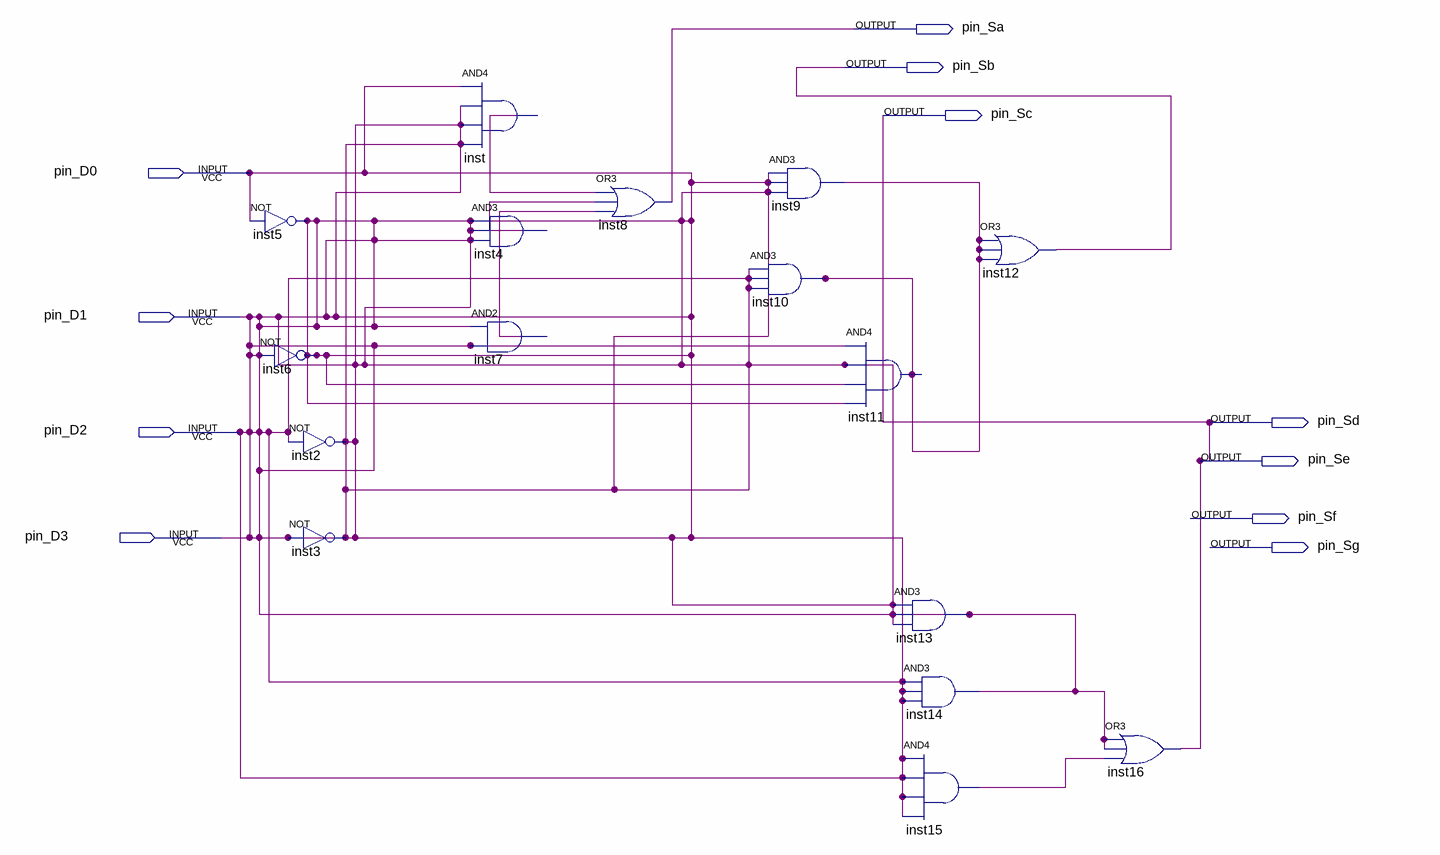
[diagram p0: schematic sheet]
// Quartus schematic Lab3.bdf as structural Verilog: 16 symbols, 11 pins
module Lab3 (
  input  pin_D0,
  input  pin_D1,
  input  pin_D2,
  input  pin_D3,
  output pin_Sa,
  output pin_Sb,
  output pin_Sc,
  output pin_Sd,
  output pin_Se,
  output pin_Sf,
  output pin_Sg
);

  wire inst4_out, inst7_out, inst9_out, inst15_out, inst_out;

  not inst5 (pin_D0, pin_D0);
  not inst6 (pin_D0, pin_D0);
  not inst2 (pin_D0, pin_D0);
  not inst3 (pin_D0, pin_D0);
  and inst (inst_out, pin_D0, pin_D0, pin_D0, pin_D0);
  and inst4 (inst4_out, pin_D0, pin_D0, pin_D0);
  and inst7 (inst7_out, pin_D0, pin_D0);
  or inst8 (pin_Sa, inst_out, inst4_out, inst7_out);
  and inst9 (inst9_out, pin_D0, pin_D0, pin_D0);
  and inst10 (inst9_out, pin_D0, pin_D0, pin_D0);
  and inst11 (inst9_out, pin_D0, pin_D0, pin_D0, pin_D0);
  and inst13 (pin_D0, pin_D0, pin_D0, pin_D0);
  and inst14 (pin_D0, pin_D0, pin_D0, pin_D0);
  and inst15 (inst15_out, pin_D0, pin_D0, pin_D0, pin_D0);
  or inst12 (pin_Sb, inst9_out, inst9_out, inst9_out);
  or inst16 (pin_Sc, pin_D0, pin_D0, inst15_out);

  assign pin_D1 = pin_D0;
  assign pin_D2 = pin_D0;
  assign pin_D3 = pin_D0;
  assign pin_Sd = pin_Sc;
  assign pin_Se = pin_Sc;
endmodule
